# Altium schematic sheet Shutdown_2019_v1.1_Faults.SchDoc: Shutdown_2019_v1.1
size 453 x 301 mm; Date: 1/4/2019 10:42:15 PM; SheetNumber: 2; GateName_1: G$1; SymbolName_1: FRAME_B_L; LibraryName: frames; DeviceSetName: FRAME_B_L; GateName_2: G$2; SymbolName_2: DOCFIELD
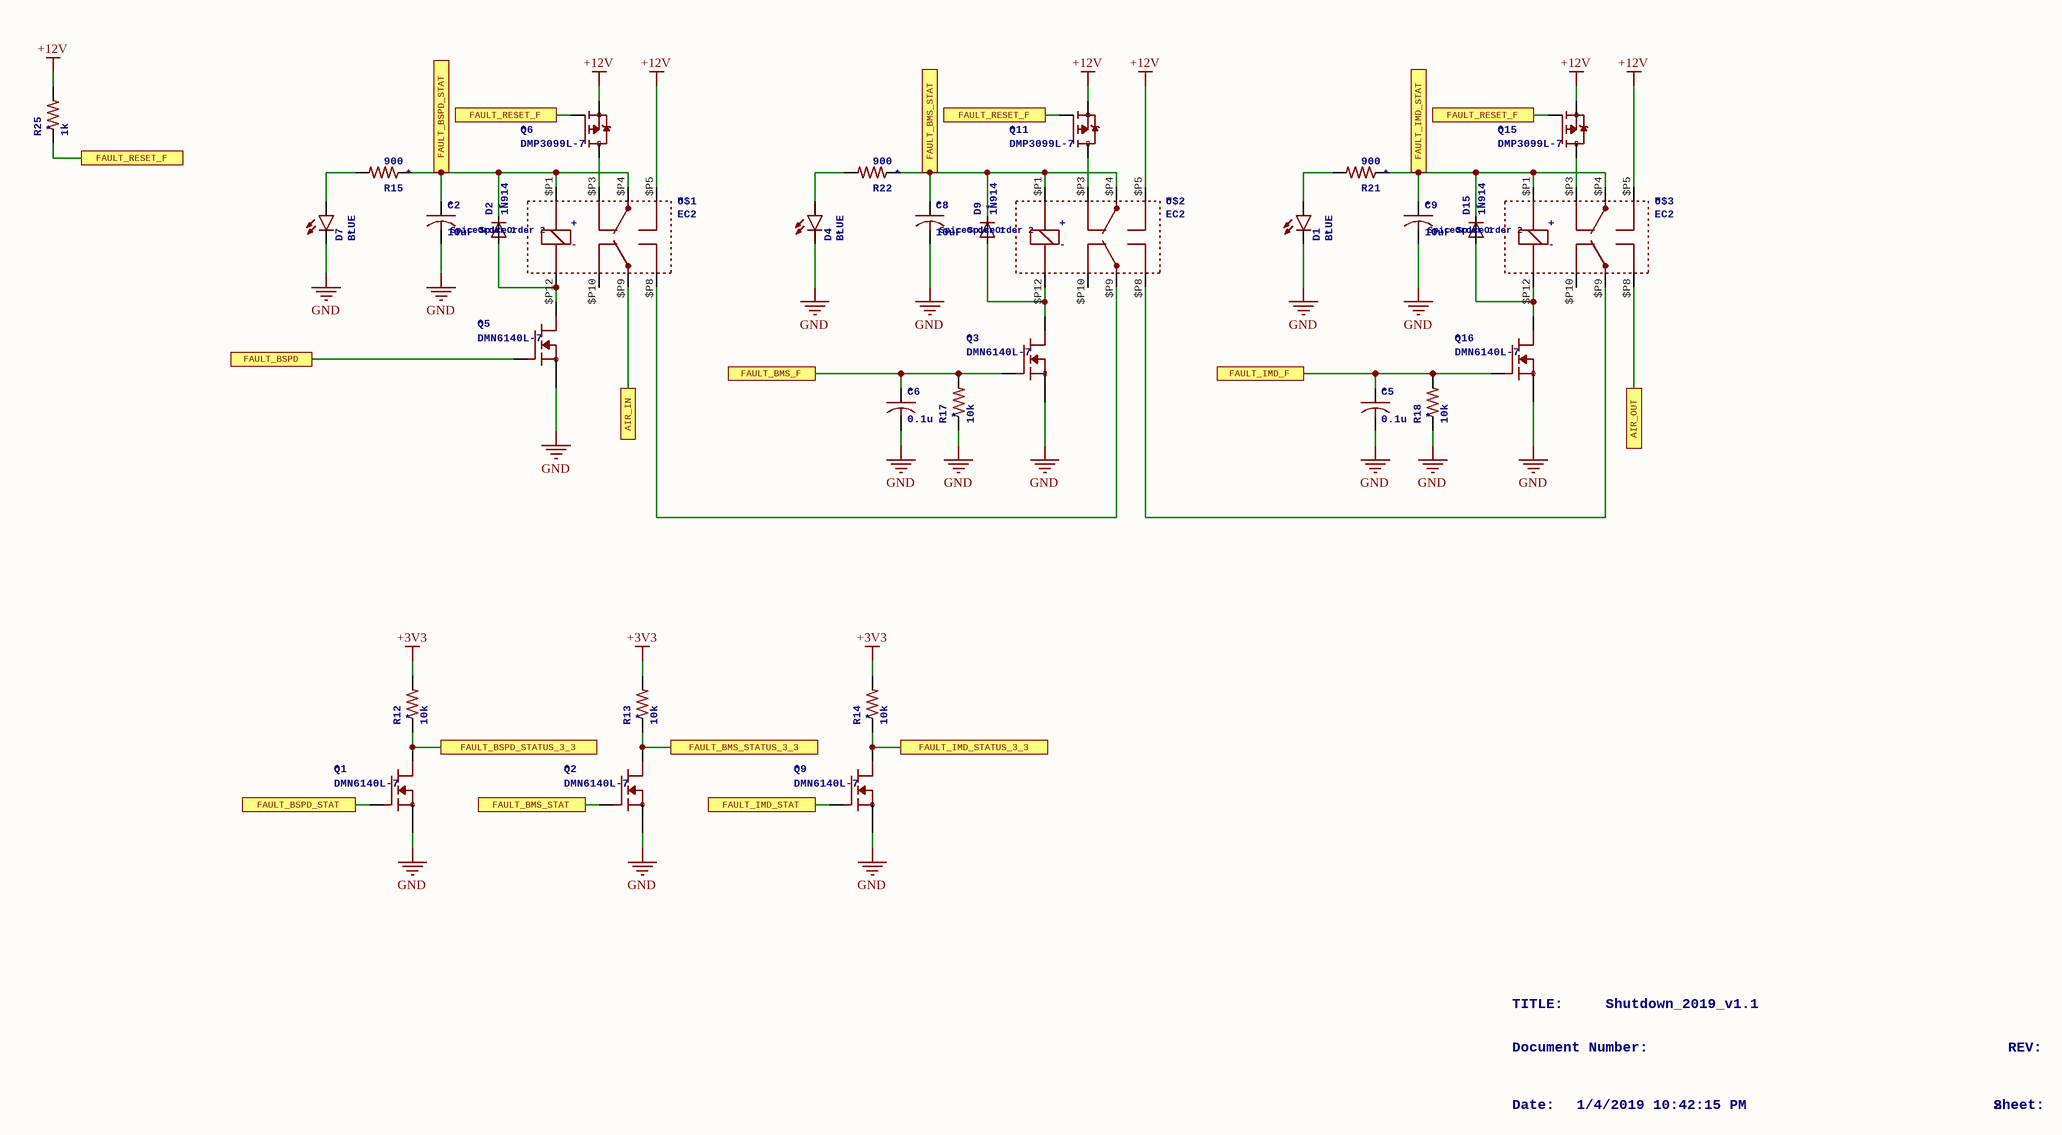
[diagram p0: Shutdown_2019_v1.1_Faults.SchDoc]

## Parts
C2  10uF  [C0805]
C5  0.1u  [C0603]
C6  0.1u  [C0603]
C8  10uF  [C0805]
C9  10uF  [C0805]
D1  BLUE  [LED-0603]
D2  1N914  SpiceOrder1: SpiceOrder 1  SpiceOrder2: SpiceOrder 2  [SOD323-F]
D4  BLUE  [LED-0603]
D7  BLUE  [LED-0603]
D9  1N914  SpiceOrder1: SpiceOrder 1  SpiceOrder2: SpiceOrder 2  [SOD323-F]
D15  1N914  SpiceOrder1: SpiceOrder 1  SpiceOrder2: SpiceOrder 2  [SOD323-F]
Q1  DMN6140L-7  [SOT23]
Q2  DMN6140L-7  [SOT23]
Q3  DMN6140L-7  [SOT23]
Q5  DMN6140L-7  [SOT23]
Q6  DMP3099L-7  [SOT23]
Q9  DMN6140L-7  [SOT23]
Q11  DMP3099L-7  [SOT23]
Q15  DMP3099L-7  [SOT23]
Q16  DMN6140L-7  [SOT23]
R12  10k  [R0603]
R13  10k  [R0603]
R14  10k  [R0603]
R15  900  [R0603]
R17  10k  [R0603]
R18  10k  [R0603]
R21  900  [R0603]
R22  900  [R0603]
R25  1k  [R0603]
U$1  EC2  [DPDT_2.54]
U$2  EC2  [DPDT_2.54]
U$3  EC2  [DPDT_2.54]

## Ports
AIR_IN, AIR_OUT, FAULT_BMS_F, FAULT_BMS_STAT, FAULT_BMS_STATUS_3_3, FAULT_BSPD, FAULT_BSPD_STAT, FAULT_BSPD_STATUS_3_3, FAULT_IMD_F, FAULT_IMD_STAT, FAULT_IMD_STATUS_3_3, FAULT_RESET_F

## Nets
+3V3: R12.2 R13.2 R14.2
+12V: Q6.2(S) Q11.2(S) Q15.2(S) R25.2 U$1.$P5 U$2.$P5 U$3.$P5
GND: C2.2 C5.2 C6.2 C8.2 C9.2 D1.C D4.C D7.C Q1.2(S) Q2.2(S) Q3.2(S) Q5.2(S) Q9.2(S) Q16.2(S) R17.1 R18.1
AIR_IN: U$1.$P9 ; port AIR_IN
AIR_OUT: U$3.$P8 ; port AIR_OUT
FAULT_BMS_F: C6.1 Q3.1(G) R17.2 ; port FAULT_BMS_F
FAULT_BMS_STAT: C8.1 D9.C Q2.1(G) R22.1 U$2.$P1 U$2.$P4 ; port FAULT_BMS_STAT
FAULT_BMS_STATUS_3_3: Q2.3(D) R13.1 ; port FAULT_BMS_STATUS_3_3
FAULT_BSPD: Q5.1(G) ; port FAULT_BSPD
FAULT_BSPD_STAT: C2.1 D2.C Q1.1(G) R15.1 U$1.$P1 U$1.$P4 ; port FAULT_BSPD_STAT
FAULT_BSPD_STATUS_3_3: Q1.3(D) R12.1 ; port FAULT_BSPD_STATUS_3_3
FAULT_IMD_F: C5.1 Q16.1(G) R18.2 ; port FAULT_IMD_F
FAULT_IMD_STAT: C9.1 D15.C Q9.1(G) R21.1 U$3.$P1 U$3.$P4 ; port FAULT_IMD_STAT
FAULT_IMD_STATUS_3_3: Q9.3(D) R14.1 ; port FAULT_IMD_STATUS_3_3
FAULT_RESET_F: Q6.1(G) Q11.1(G) Q15.1(G) R25.1 ; port FAULT_RESET_F
NetD1_A: D1.A R21.2
NetD2_A: D2.A Q5.3(D) U$1.$P12
NetD4_A: D4.A R22.2
NetD7_A: D7.A R15.2
NetD9_A: D9.A Q3.3(D) U$2.$P12
NetD15_A: D15.A Q16.3(D) U$3.$P12
NetQ6_3: Q6.3(D) U$1.$P3
NetQ11_3: Q11.3(D) U$2.$P3
NetQ15_3: Q15.3(D) U$3.$P3
NetU$1_$P8: U$1.$P8 U$2.$P9
NetU$2_$P8: U$2.$P8 U$3.$P9

Not connected (* = marked no-connect by the designer): U$1 $P10; U$2 $P10; U$3 $P10

## Notes on the sheet
- TITLE:
- Document Number:
- Shutdown_2019_v1.1
- REV:
- Date:
- 1/4/2019 10:42:15 PM
- Sheet:
- 2
- 1
- 3
- 4
- 5
- 6
- 7
- 8
- 9
- A
- B
- C
- D
- E
- F

## Library data of the parts
C2 C8 C9 = C-USC0805: CAPACITOR, American symbol; GateName_1: G$1; SymbolName_1: C-US; DeviceName: C0805; LibraryName: rcl; DeviceSetName: C-US; NAME: *; SPICEPREFIX: C
C5 C6 = C-USC0603: CAPACITOR, American symbol; GateName_1: G$1; SymbolName_1: C-US-1; DeviceSetName: C-US; DeviceName: C0603; LibraryName: resistor; NAME: *
D1 D4 D7 = LED-BLUE0603: Blue LEDs for production useVarious blue LEDs stocked by SparkFun production0603 - DIO-08575Rebel - DIO-095531206 - DIO-09911; GateName_1: G$1; SymbolName_1: LED; DeviceName: 0603; LibraryName: SparkFun-LED; DeviceSetName: LED-BLUE; NAME: *; PROD_ID: DIO-08575
D2 D9 D15 = 1N914: GateName_1: G$1; SymbolName_1: D; LibraryName: Diodes; DeviceSetName: 1N914; NAME: *
Q1-Q3 Q5 Q9 Q16 = DMN6140L-7: DMN6140L-7 Vgs(th) = 3V, Rds(on) = 140mOhm, Vds(max) = 60V; GateName_1: G$1; SymbolName_1: N-MOSFET-GDS; LibraryName: TRANS; DeviceSetName: DMN6140L-7; NAME: *
Q6 Q11 Q15 = DMP3099L-7: DMP3099L-7  P-Channel Vgs(th) = 2.1V, Rds(on) = 64 mohm, Vds(max) = 30V; GateName_1: G$1; SymbolName_1: P-MOSFET; LibraryName: TRANS; DeviceSetName: DMP3099L-7; NAME: *
R12-R15 R17 R18 R21 R22 R25 = R-US_R0603: RESISTOR, American symbol; GateName_1: G$1; SymbolName_1: R-US; DeviceSetName: R-US_; DeviceName: R0603; LibraryName: resistor; NAME: *
U$1-U$3 = EC2: KEMET EC2 DPDT General Purpose 2A Relay. 12V coil voltage.Datasheet Digikey; GateName_1: G$1; SymbolName_1: MONOSTABLERELAY; LibraryName: KEMET; DeviceSetName: EC2; NAME: *; +: +; -: -